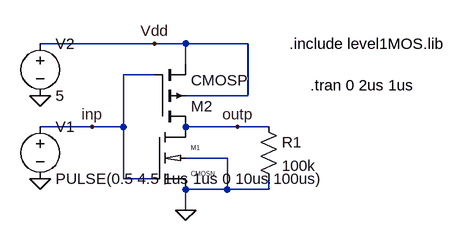
[diagram p0: schematic inverter.asc]
inverter.asc, the LTspice schematic file:
Version 4
SHEET 1 880 680
WIRE 144 48 -32 48
WIRE 192 48 144 48
WIRE 288 48 192 48
WIRE 192 80 192 48
WIRE 144 96 96 96
WIRE 288 128 288 48
WIRE 288 128 192 128
WIRE 48 176 -32 176
WIRE 96 176 96 96
WIRE 96 176 48 176
WIRE 272 176 192 176
WIRE 320 176 272 176
WIRE 256 224 192 224
WIRE 96 256 96 176
WIRE 144 256 96 256
WIRE 256 272 256 224
WIRE 256 272 192 272
WIRE 320 272 320 256
WIRE 320 272 256 272
WIRE 192 304 192 272
FLAG 192 304 0
FLAG -32 128 0
FLAG -32 256 0
FLAG 144 48 Vdd
FLAG 272 176 outp
FLAG 48 176 inp
SYMBOL cmosn 144 176 R0
SYMATTR InstName M1
SYMATTR Value2 l=0.36u w=0.72u
SYMBOL cmosp 144 176 M180
SYMATTR InstName M2
SYMATTR Value2 l=0.36u w=1.44u
SYMBOL voltage -32 160 R0
WINDOW 123 0 0 Left 2
WINDOW 39 0 0 Left 2
SYMATTR InstName V1
SYMATTR Value PULSE(0.5 4.5 1us 1us 0 10us 100us)
SYMBOL voltage -32 32 R0
WINDOW 123 0 0 Left 2
WINDOW 39 0 0 Left 2
SYMATTR InstName V2
SYMATTR Value 5
SYMBOL res 304 160 R0
SYMATTR InstName R1
SYMATTR Value 100k
TEXT 352 48 Left 2 !.include level1MOS.lib
TEXT 384 112 Left 2 !.tran 0 2us 1us

The netlist it stands for:
* inverter.asc
M1 outp inp 0 0 CMOSN l=0.36u w=0.72u
M2 outp inp Vdd Vdd CMOSP l=0.36u w=1.44u
V1 inp 0 PULSE(0.5 4.5 1us 1us 0 10us 100us)
V2 Vdd 0 5
R1 outp 0 100k
.model NMOS NMOS
.model PMOS PMOS
.lib standard.mos
.include level1MOS.lib
.tran 0 2us 1us
.lib tsmc018.lib
.backanno
.end

* Results of the author's LTspice run, read from the files saved beside the schematic
* Operating Point, zero values left out:
*   V(outp) = 4.964 V
*   V(inp) = 500 mV
*   V(vdd) = 5 V
*   Id(M2) = -49.89 µA
*   Is(M2) = 49.89 µA
*   Id(M1) = 255.5 nA
*   Ib(M1) = -4.974 pA
*   Is(M1) = -255.5 nA
*   I(R1) = 49.64 µA
*   I(V2) = -49.89 µA
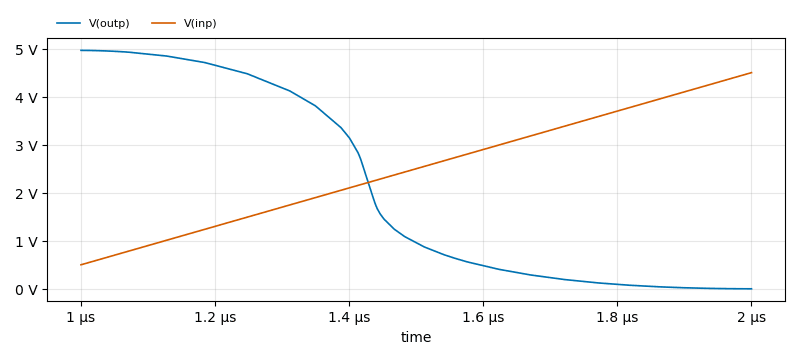
[diagram p1: Transient Analysis of inverter.asc, plotted from the saved traces]
* Transient Analysis, 1 run:
*   V(outp): min 61.15 µV, max 4.964 V, average 2.092 V, rms 2.924 V, last 61.15 µV
*   V(inp): min 500 mV, max 4.5 V, average 2.5 V, rms 2.755 V, last 4.5 V